# Altium schematic sheet [01] COVER PAGE.SchDoc
size A3; CheckedBy: R. LIPAR; Author: R. LIPAR; CompanyName: Pelinci; DrawnBy: R. LIPAR; Engineer: R. LIPAR; Organization: Pelinci; Address2: SI-4208 Sencur; Address3: Slovenia
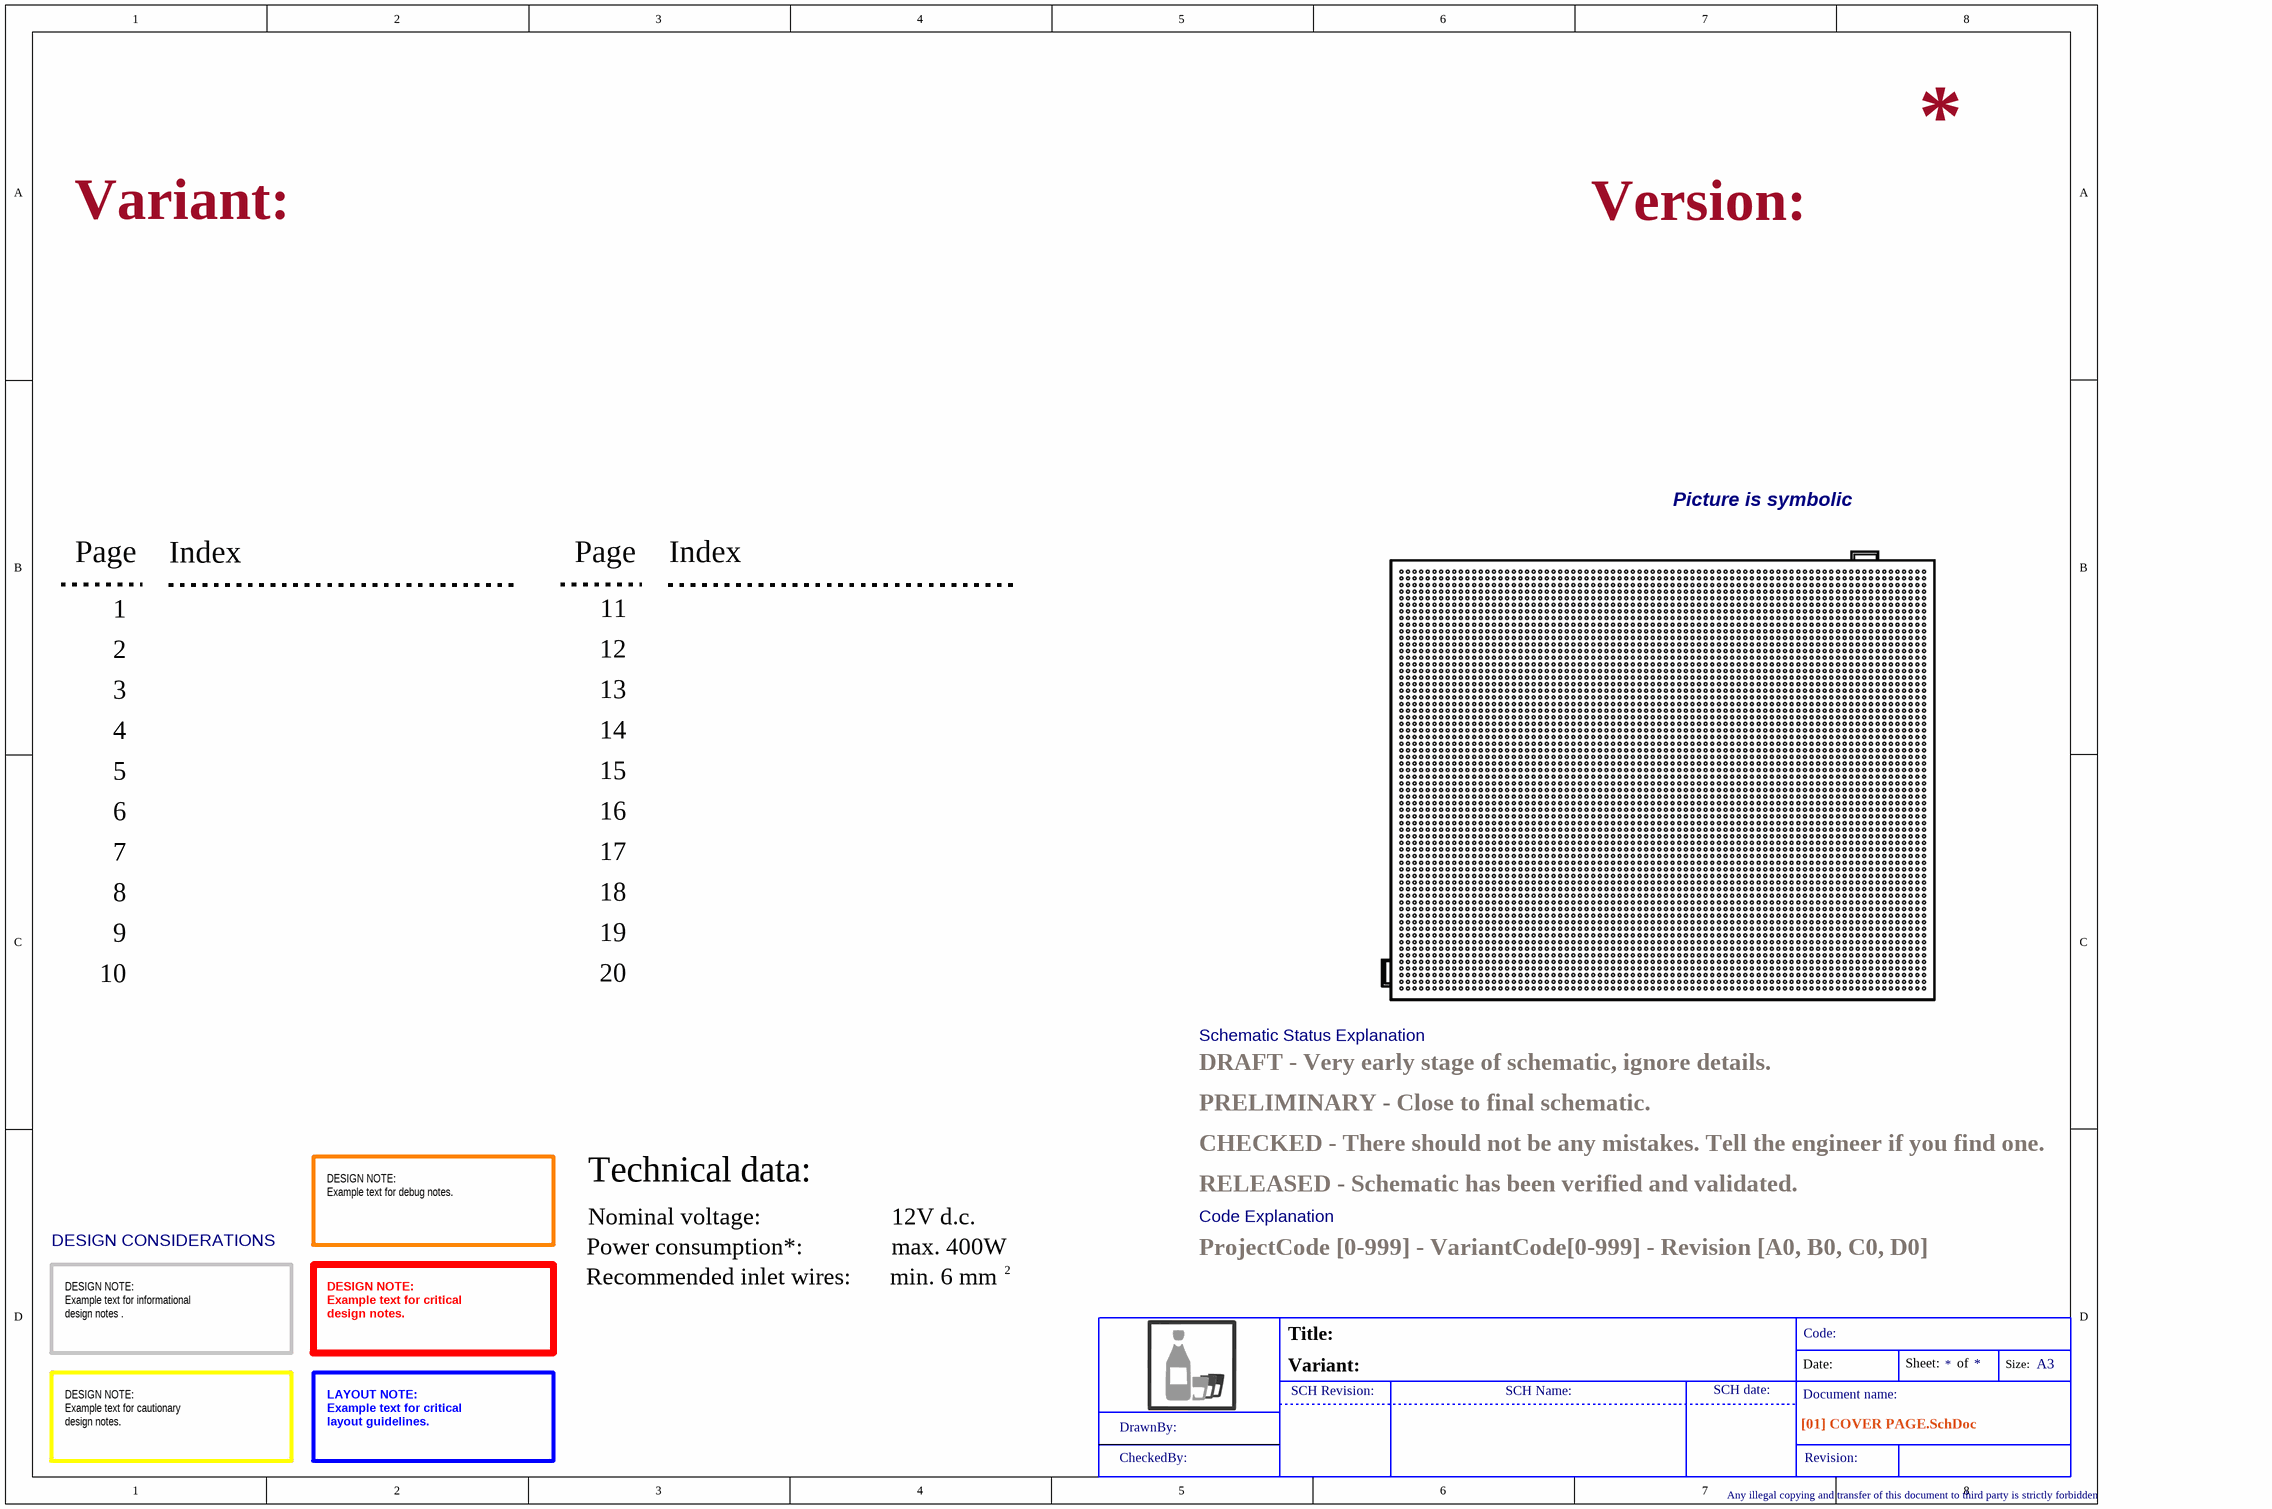
[diagram p0: [01] COVER PAGE.SchDoc]

## Sub-sheets
TOP LEVEL = [03] TOP LEVEL.SchDoc: no entries
TOP LEVEL = [02]BLOCK DIAGRAM.SchDoc: no entries

## Notes on the sheet
- Variant:
- Version:
- Picture is symbolic
- Page
- Index
- 1
- 11
- 2
- 3
- 12
- 13
- 4
- 5
- 14
- 15
- 6
- 16
- 7
- 8
- 17
- 18
- 9
- 10
- 19
- 20
- Schematic Status Explanation
- PRELIMINARY - Close to final schematic.
- DRAFT - Very early stage of schematic, ignore details.
- Technical data:
- RELEASED - Schematic has been verified and validated.
- CHECKED - There should not be any mistakes. Tell the engineer if you find one.
- DESIGN CONSIDERATIONS
- DESIGN NOTE:
  Example text for debug notes.
- Power consumption*:
- Nominal voltage:
- 12V d.c.
- max. 400W
- Code Explanation
- ProjectCode [0-999] - VariantCode[0-999] - Revision [A0, B0, C0, D0]
- Recommended inlet wires:
- min. 6 mm
- DESIGN NOTE:
  Example text for informational
  design notes .
- DESIGN NOTE:
  Example text for critical
  design notes.
- DESIGN NOTE:
  Example text for cautionary
  design notes.
- LAYOUT NOTE:
  Example text for critical
  layout guidelines.
- Title:
- SCH Revision:
- SCH Name:
- SCH date:
- Date:
- Code:
- Sheet:
- of
- Size:
- A3
- DrawnBy:
- CheckedBy:
- Document name:
- Revision:
- Any illegal copying and transfer of this document to third party is strictly forbidden